# EAGLE design Router40 v1 (EAGLE 9.5.0)
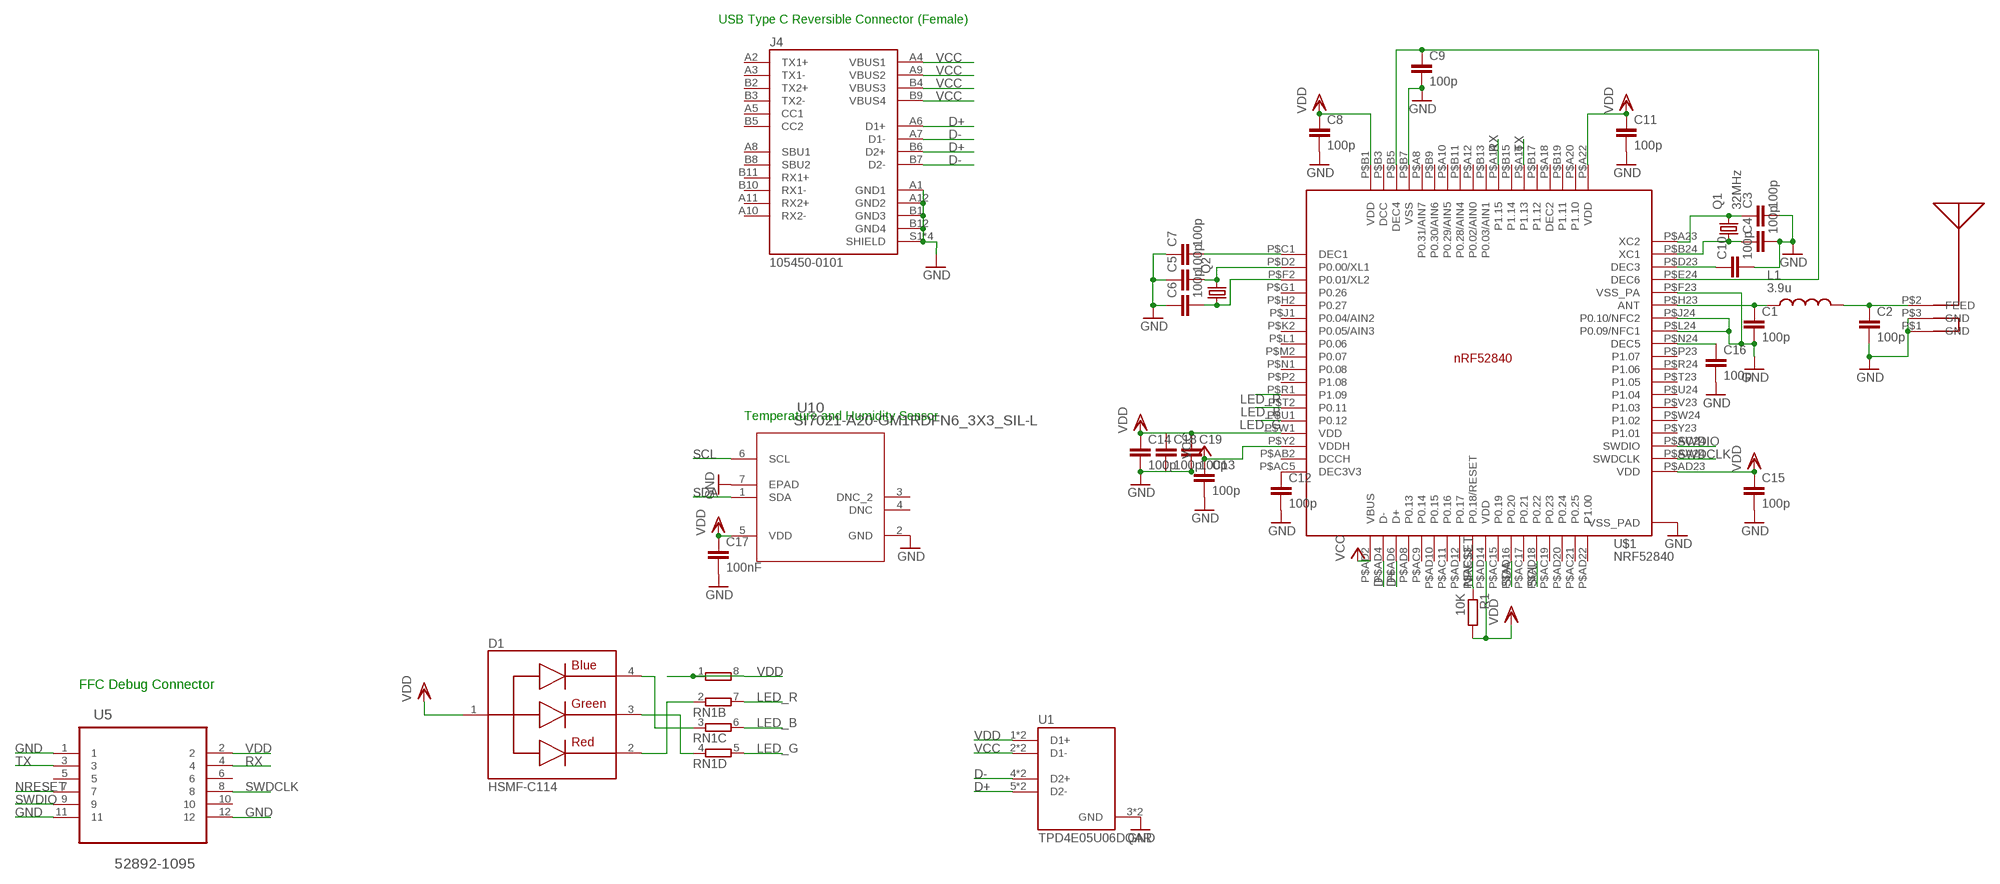
[diagram p0: schematic, sheet 1]

## Parts
C1  100p  CC0402  [C0402]
C2  100p  CC0402  [C0402]
C3  100p  CC0402  [C0402]
C4  100p  CC0402  [C0402]
C5  100p  CC0402  [C0402]
C6  100p  CC0402  [C0402]
C7  100p  CC0402  [C0402]
C8  100p  CC0402  [C0402]
C9  100p  CC0402  [C0402]
C10  100p  CC0402  [C0402]
C11  100p  CC0402  [C0402]
C12  100p  CC0402  [C0402]
C13  100p  CC0402  [C0402]
C14  100p  CC0402  [C0402]
C15  100p  CC0402  [C0402]
C16  100p  CC0402  [C0402]
C17  100nF  CC0402  [C0402]
C18  100p  CC0402  [C0402]
C19  100p  CC0402  [C0402]
D1  HSMF-C114  [DIOSC160X150X35-4N]
J4  105450-0101  [MOLEX_105450-0101]
L1  3.9u  MHQ0402P7N5JT000  [INDC0402X26N]
Q1  32MHz  KX-5  [2.0X1.6_KX-5]
Q2  KX-327-RT  [2.0X1.2]
R1  10K  RR0402  [R0402]
RN1  4R-N0402ARV341  [4X0402ARV341]
U1  TPD4E05U06DQAR  [TI_TPD4E05U06DQAR]
U5  52892-1095  [MOLEX_52892-1095]
U10  SI7021-A20-GM1RDFN6_3X3_SIL-L  [DFN6_3X3_SIL-L]
U$1  NRF52840  [AQFN50P700X700X85_HS-74N]
U$4  CHIPANTENNAL2  [CHIPANTENNAL2]

## Nets
D+: J4.A6(D1+) J4.B6(D2+) U1.5(D2-) U1.6(D2-) U$1.P$AD6(D+)
D-: J4.A7(D1-) J4.B7(D2-) U1.4(D2+) U1.7(D2+) U$1.P$AD4(D-)
GND: C1.2 C2.2 C3.2 C4.2 C5.1 C6.1 C7.1 C8.2 C9.2 C10.2 C11.2 C12.2 C13.2 C14.2 C15.2 C16.2 C17.2 C18.2 C19.2 J4.A1(GND1) J4.A12(GND2) J4.B1(GND3) J4.B12(GND4) J4.S1(SHIELD) J4.S2(SHIELD) J4.S3(SHIELD) J4.S4(SHIELD) U1.3(GND) U1.8(GND) U5.1 U5.11 U5.12 U10.2(GND) U10.7(EPAD) U$1.P$74(VSS_PAD) U$1.P$75(VSS_PAD) U$1.P$76(VSS_PAD) U$1.P$77(VSS_PAD) U$1.P$78(VSS_PAD) U$1.P$79(VSS_PAD) U$1.P$80(VSS_PAD) U$1.P$81(VSS_PAD) U$1.P$82(VSS_PAD) U$1.P$83(VSS_PAD) U$1.P$84(VSS_PAD) U$1.P$85(VSS_PAD) U$1.P$86(VSS_PAD) U$1.P$87(VSS_PAD) U$1.P$88(VSS_PAD) U$1.P$89(VSS_PAD) U$1.P$90(VSS_PAD) U$1.P$B7(VSS) U$1.P$F23(VSS_PA) U$1.P$J24(P0.10/NFC2) U$1.P$L24(P0.09/NFC1) U$4.P$1(GND) U$4.P$3(GND)
LED_B: RN1.6 U$1.P$T2(P0.11)
LED_G: RN1.5 U$1.P$U1(P0.12)
LED_R: RN1.7 U$1.P$R1(P1.09)
N$1: C1.1 L1.1 U$1.P$H23(ANT)
N$2: C2.1 L1.2 U$4.P$2(FEED)
N$3: C3.1 Q1.3 U$1.P$A23(XC2)
N$4: C4.1 Q1.1 U$1.P$B24(XC1)
N$5: C5.2 Q2.2 U$1.P$D2(P0.00/XL1)
N$6: C6.2 Q2.1 U$1.P$F2(P0.01/XL2)
N$7: C7.2 U$1.P$C1(DEC1)
N$8: C9.1 U$1.P$B5(DEC4) U$1.P$E24(DEC6)
N$9: C10.1 U$1.P$D23(DEC3)
N$10: C12.1 U$1.P$AC5(DEC3V3)
N$12: C16.1 U$1.P$N24(DEC5)
N$16: D1.2 RN1.2
N$17: D1.3 RN1.4
N$18: D1.4 RN1.3
NRESET: R1.1 U5.7 U$1.P$AC13(P0.18/RESET)
RX: U5.4 U$1.P$A14(P1.15)
SCL: U10.6(SCL) U$1.P$AD18(P0.22)
SDA: U10.1(SDA) U$1.P$AD16(P0.20)
SWDCLK: U5.8 U$1.P$AA24(SWDCLK)
SWDIO: U5.9 U$1.P$AC24(SWDIO)
TX: U5.3 U$1.P$A16(P1.13)
VCC: C13.1 J4.A4(VBUS1) J4.A9(VBUS2) J4.B4(VBUS3) J4.B9(VBUS4) U1.2(D1-) U1.9(D1-) U$1.P$AD2(VBUS) U$1.P$Y2(VDDH)
VDD: C8.1 C11.1 C14.1 C15.1 C17.1 C18.1 C19.1 D1.1 R1.2 RN1.1 RN1.8 U1.1(D1+) U1.10(D1+) U5.2 U10.5(VDD) U$1.P$A22(VDD) U$1.P$AD14(VDD) U$1.P$AD23(VDD) U$1.P$B1(VDD) U$1.P$W1(VDD)
Unconnected: J4.A2(TX1+) J4.A3(TX1-) J4.A5(CC1) J4.A8(SBU1) J4.A10(RX2-) J4.A11(RX2+) J4.B2(TX2+) J4.B3(TX2-) J4.B5(CC2) J4.B8(SBU2) J4.B10(RX1-) J4.B11(RX1+) U5.5 U5.6 U5.10 U10.3(DNC_2) U10.4(DNC) U$1.P$A8(P0.31/AIN7) U$1.P$A10(P0.29/AIN5) U$1.P$A12(P0.02/AIN0) U$1.P$A18(DEC2) U$1.P$A20(P1.10) U$1.P$AB2(DCCH) U$1.P$AC9(P0.14) U$1.P$AC11(P0.16) U$1.P$AC15(P0.19) U$1.P$AC17(P0.21) U$1.P$AC19(P0.23) U$1.P$AC21(P0.25) U$1.P$AD8(P0.13) U$1.P$AD10(P0.15) U$1.P$AD12(P0.17) U$1.P$AD20(P0.24) U$1.P$AD22(P1.00) U$1.P$B3(DCC) U$1.P$B9(P0.30/AIN6) U$1.P$B11(P0.28/AIN4) U$1.P$B13(P0.03/AIN1) U$1.P$B15(P1.14) U$1.P$B17(P1.12) U$1.P$B19(P1.11) U$1.P$G1(P0.26) U$1.P$H2(P0.27) U$1.P$J1(P0.04/AIN2) U$1.P$K2(P0.05/AIN3) U$1.P$L1(P0.06) U$1.P$M2(P0.07) U$1.P$N1(P0.08) U$1.P$P2(P1.08) U$1.P$P23(P1.07) U$1.P$R24(P1.06) U$1.P$T23(P1.05) U$1.P$U24(P1.04) U$1.P$V23(P1.03) U$1.P$W24(P1.02) U$1.P$Y23(P1.01)

## Notes on the sheet
- USB Type C Reversible Connector (Female)
- Temperature and Humidity Sensor
- FFC Debug Connector

## Library data of the parts
C1-C19 = eagle-ltspice:C: CAPACITOR, European symbol; SPICEMODEL: NONE; SPICEPREFIX: C
D1 = HSMF-C114:HSMF-C114: LED Tri-Color Blue/Green/Red 468nm/523nm/637nm 4-Pin Chip LED T/R; AVAILABILITY: Unavailable; DESCRIPTION: LED RGB DIFFUSED CHIP SMD; MF: Broadcom Limited; MP: HSMF-C114; PACKAGE: 0606 Broadcom; PRICE: None
J4 = 105450-0101:105450-0101: USB Shielded I/O Receptacle; Type C; Right Angle; Surface Mount; Gold over Nickel; AVAILABILITY: Unavailable; DESCRIPTION: USB-C (USB TYPE-C) USB 3.1 (USB 3.1 Gen 2, Superspeed+) Receptacle Connector 24 Position Surface Mount, Right Angle; Through Hole; MF: Molex; MP: 1054500101; PACKAGE: None; PRICE: None
L1 = MHQ0402P7N5JT000:MHQ0402P7N5JT000: 221 NH 5% GOLD TERMINAL; AVAILABILITY: Unavailable; DESCRIPTION: FIXED IND 7.5NH 200MA 1.2 OHM; MF: TDK; MP: MHQ0402P7N5JT000; PACKAGE: 0402 TDK; PRICE: None
Q1 = crystal-geyer_V1_0:KX: Quartz Crystals (MHz) SMD: KX - Serie Model Size l/w/h [mm] Frequency Range Frequency Stability Temp. Range [°C] Load Capacitance AECQ 200 availabel Datasheet KX-4 KX-5 KX-6 KX-7 KX-9A KX-9B KX-12A KX-12B KX-13 KX-20 KX-K KX-KS 1.6/1.2/0.3 2.0/1.6/0.45 2.5/2.0/0.55 3.2/2.5/0.8 5.0/3.2/1.0 5.0/3.2/1.1 6.0/3.5/1.1 6.0/3.5/1.0 7.0/5.0 /1.3 11.6/5.5/1.6 12.3/4.5/4.2 12.3/4.5/3.2 24.0 ~ 80.0 MHz 16.0 ~ 80.0 MHz 12.0 ~ 80.0 MHz 8.0 ~ 60.0 MHz 7,68 ~ 300,0 MHz 8,0 ~ 50,0 MHz 8,0 ~ 150,0 MHz 8,0 ~ 50,0 MHz 6,0 ~ 160,0 MHz 3,579 ~ 25,0 MHz 3,579 ~ 70,0 MHz 3,579 ~ 70,0 MHz ±10 … ±50ppm ±10 … ±50ppm ±10 … ±50ppm ±10 … ±50ppm ±10 … ±50ppm ±10 … ±50ppm ±10 … ±50ppm ±10 … ±50ppm ±10 … ±50ppm ±50ppm ±10 … ±50ppm ±10 … ±50ppm (*) -40°C …+85°C (*) -40°C …+125°C (*) -40°C …+125°C (*) -40°C …+125°C (*) -40°C …+105°C (*) -40°C …+105°C (*) -40°C …+125°C (*) -40°C …+105°C (*) -40°C …+105°C (*) -40°C …+105°C (*) -40°C …+85°C (*) -40°C …+85°C 8, 8…16 8, 8…16 10, 8…16 12, 7…20 16, 10…20 16, 10…20 16, 10…20 16, 12…20 16, 12…20 16, 12…20 16, 12…30 16, 12…30 - yes yes yes - - - - - - - - KX-4.pdf <http://www.geyer-electronic.de/uploads/tx_userartikelfrequenz/GEYER-KX-4.pdf> KX-5.pdf <http://www.geyer-electronic.de/uploads/tx_userartikelfrequenz/GEYER-KX-5.pdf> KX-6.pdf <http://www.geyer-electronic.de/uploads/tx_userartikelfrequenz/GEYER-KX-6.pdf> KX-7.pdf <http://www.geyer-electronic.de/uploads/tx_userartikelfrequenz/GEYER-KX-7.pdf> KX-9A.pdf <http://www.geyer-electronic.de/uploads/tx_userartikelfrequenz/GEYER-KX-9A.pdf> KX-9B.pdf <http://www.geyer-electronic.de/uploads/tx_userartikelfrequenz/GEYER-KX-9B.pdf> KX-12A.pdf <http://www.geyer-electronic.de/uploads/tx_userartikelfrequenz/GEYER-KX-12A.pdf> KX-12B.pdf <http://www.geyer-electronic.de/uploads/tx_userartikelfrequenz/GEYER-KX-12B.pdf> KX-13.pdf <http://www.geyer-electronic.de/uploads/tx_userartikelfrequenz/GEYER-KX-13.pdf> KX-20.pdf <http://www.geyer-electronic.de/uploads/tx_userartikelfrequenz/GEYER-KX-20.pdf> KX-K.pdf <http://www.geyer-electronic.de/uploads/tx_userartikelfrequenz/GEYER-KX-K.pdf> KX-KS.pdf <http://www.geyer-electronic.de/uploads/tx_userartikelfrequenz/GEYER-KX-KS.pdf> <http://www.geyer-electronic.de/fileadmin/template/img/logo-geyer-electronic.png> Details see: http://www.geyer-electronic.de/Frequenz-Produkte.9.0.html Created 2016-06-07, Hans Locher 2016 (C) Geyer Quartz Technology KX4,KX5,KX6,KX7,KX9A,KX9B,KX12A,KX12B,KX13,KX20,KXK,KXKS;1612;2016;2520;3225;5032;6035;7050;11655;12345;1,6x1,2;2,0x1,6;2,5x2,0;3,2x2,5;5,0x3,2;6,0x3,5;7,0x5,0;11,6x5,5;12,3x4,5;12,3x4,5;1.6x1.2;2.0x1.6;2.5x2.0;3.2x2.5;5.0x3.2;6.0x3.5;7.0x5.0;11.6x5.5;12.3x4.5;12.3x4.5;
Q2 = crystal-geyer_V1_0:KX-327: Tuning Fork Crystals (kHz) SMD: KX327 - Serie Model Size l/w/h [mm] Frequency Range Frequency Stability Temp. Range [°C] Load Capacitance AECQ 200 availabel Datasheet KX-327VT KX-327FT KX-327RT KX-327NHT KX-327NHF KX-327L KX-327S 1.25/1.05/0.5 1.6/1.0/0.5 2.0/1.2/0.6 3.2/1.5/0.8 3.2/1.5/0.8 7.0/1.5/1.4 8.2/3.8/2.5 32,768 kHz 32,768 kHz 32,768 kHz 32,768 kHz 32,768 kHz 32,768 kHz 32,768 kHz ±10 … ±20ppm ±10 … ±20ppm ±10 … ±20ppm ±10 … ±20ppm ±10 … ±20ppm ±10 … ±20ppm ±5 … ±20ppm (*) -40°C …+85°C (*) -40°C …+85°C (*) -40°C …+85°C (*) -40°C …+85°C (*) -40°C …+125°C (*) -40°C …+85°C (*) -40°C …+85°C 7/9/12,5 7/9/12,5 7/9/12,6 7/9/12,5 9/12,5 7/9/12,5 6/12,5 - - - - yes - - KX-327VT.pdf <http://www.geyer-electronic.de/uploads/tx_userartikelfrequenz/GEYER-KX-327VT.pdf> KX-327FT.pdf <http://www.geyer-electronic.de/uploads/tx_userartikelfrequenz/GEYER-KX-327FT.pdf> KX-327RT.pdf <http://www.geyer-electronic.de/uploads/tx_userartikelfrequenz/GEYER-KX-327RT.pdf> KX-327NHT.pdf <http://www.geyer-electronic.de/uploads/tx_userartikelfrequenz/GEYER-KX-327NHT.pdf> KX-327NHF.pdf <http://www.geyer-electronic.de/uploads/tx_userartikelfrequenz/GEYER-KX-327NHF.pdf> KX-327L.pdf <http://www.geyer-electronic.de/uploads/tx_userartikelfrequenz/GEYER-KX-327L.pdf> KX-327S.pdf <http://www.geyer-electronic.de/uploads/tx_userartikelfrequenz/GEYER-KX-327S.pdf> <http://www.geyer-electronic.de/fileadmin/template/img/logo-geyer-electronic.png> Details see: http://www.geyer-electronic.de/Frequenz-Produkte.9.0.html Created 2016-06-07, Hans Locher 2016 (C) Geyer Quartz Technology KX327VT,KX327FT,KX327RT,KX327NHT,KX327NHF,KX327S,KX327L;125105;1610;2012;3215;7015;8238;1,25x1,05,1.25x1.05;1,6x1,0,1.6x1.0;2,0x1,2,2.0x1.2;3,2x1,5,3.2x1.5;8,2x3,8,8.2x3.8,7.0x1.5,7,0x1,532.768kHz
R1 = eagle-ltspice:R: RESISTOR, European symbol; SPICEMODEL: NONE; SPICEPREFIX: R
RN1 = resistor-dil:4R-N: Array Chip Resistor Source: RS Component / Phycomp; OC_FARNELL: unknown; OC_NEWARK: unknown
U1 = TPD4E05U06DQAR:TPD4E05U06DQAR: 4 Channel Ultra Low Capacitance IEC ESD Protection Diodes 10-USON -40 to 125 Check prices <https://pricing.snapeda.com/search/part/TPD4E05U06DQAR/?ref=eda>; AVAILABILITY: Warning; DESCRIPTION: 4-channel ultra-low-capacitance IEC ESD protection diode 10-USON -40 to 125; MF: Texas Instruments; MP: TPD4E05U06DQAR; PACKAGE: USON-10 Texas Instruments; PRICE: None; PURCHASE-URL: https://pricing.snapeda.com/search/part/TPD4E05U06DQAR/?ref=eda
U5 = 52892-1095:52892-1095: CONNECTOR, FPC, ZIF, 0.50MM, 10 WAY; AVAILABILITY: Unavailable; DESCRIPTION: Socket, r/a, Fpc, Zif, Smt, 10way; MF: Molex; MP: 52892-1095; PACKAGE: None; PRICE: None
U10 = SI7021:SI7021-A20-GM1R; BUILT_BY: EMA_Jessica; COPYRIGHT: Copyright (C) 2018 Accelerated Designs. All rights reserved; MANUFACTURER_PART_NUMBER: SI7021-A20-GM1R; SOURCELIBRARY: Silicon_Labs_2020-01-01; VENDOR: Silicon Labs
U$1 = Nordic_nRF:NRF52840: nRF52840 Features Advanced Single chip 2.4 GHz multi-protocol SoC 32-bit ARM Cortex-M4F Processor 1.7v to 5.5v operation 1MB flash + 256kB RAM Bluetooth 5 support for long range and high throughput 802.15.4 radio support On-chip NFC PPI –Programmable Peripheral Interconnect Automated power management system with automatic power management of each peripheral Configurable I/O mapping for analog and digital I/O 48 x GPIO 1 x QSPI 4 x Master/Slave SPI 2 x Two-wire interface (I²C) I²S interface 2 x UART 4 x PWM USB 2.0 controller ARM TrustZone CryptoCell-310 Cryptographic and security module AES 128-bit ECB/CCM/AAR hardware accelerator Digital microphone interface (PDM) Quadrature decoder 12-bit ADC Low power comparator On-chip 50Ω balun On-air compatible with nRF52, nRF51 and nRF24 Series Applications Advanced high performance wearables Wearables for secure payments Virtual Reality/Augmented Reality systems Smart Home sensor networks Smart city sensor networks High performance HID controllers Internet of Things (IoT) sensor networks Smart door locks Smart lighting networks Connected white goods
U$4 = CHIPANTENNA:CHIPANTENNAL2

## Board
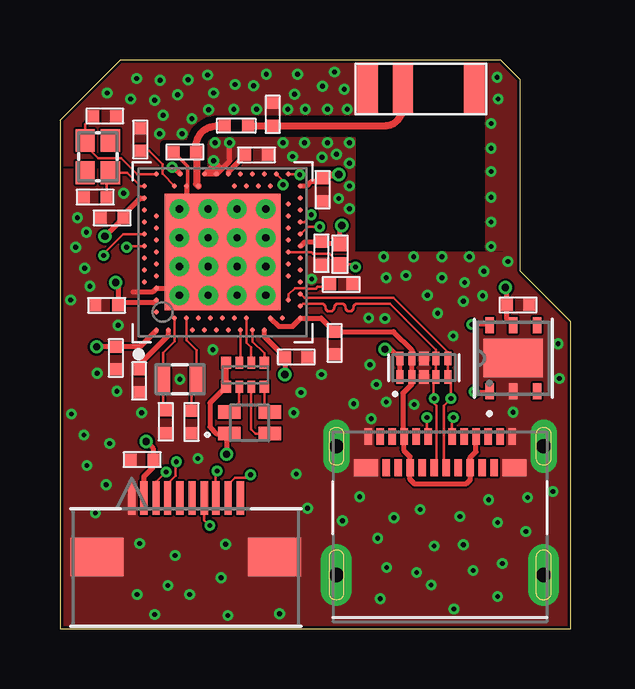
[diagram p1: board, top side]
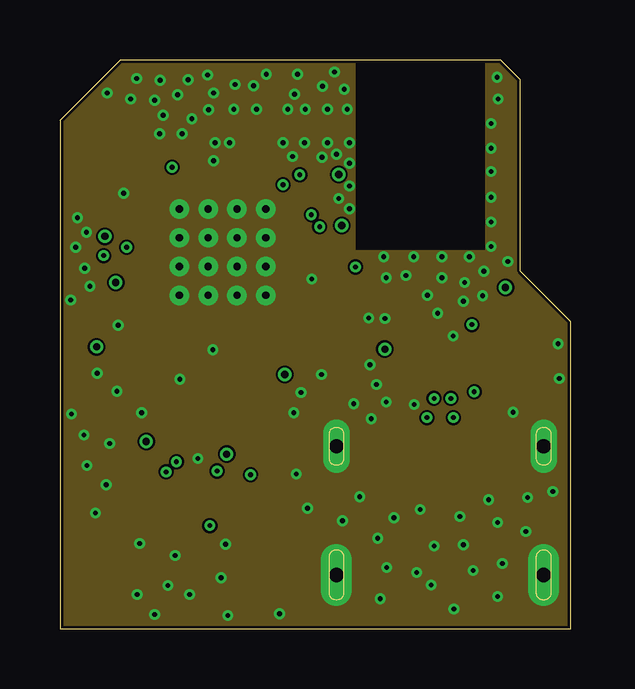
[diagram p2: board, inner layer Route2]
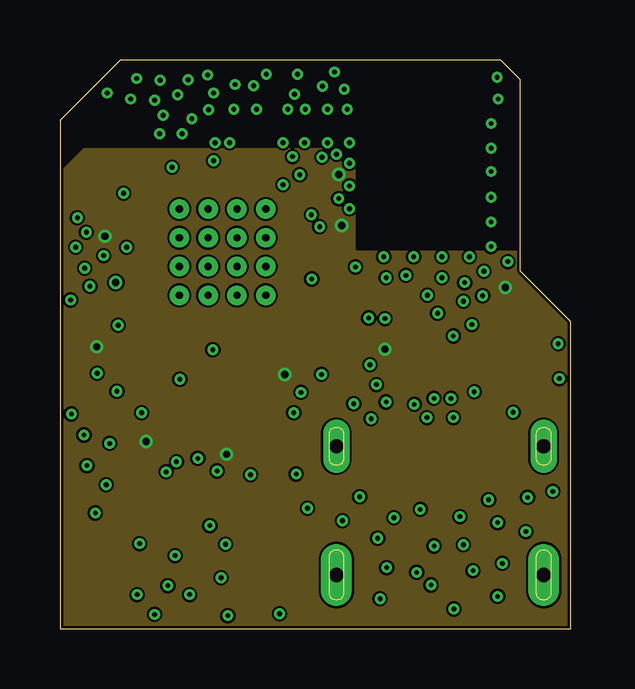
[diagram p3: board, inner layer Route15]
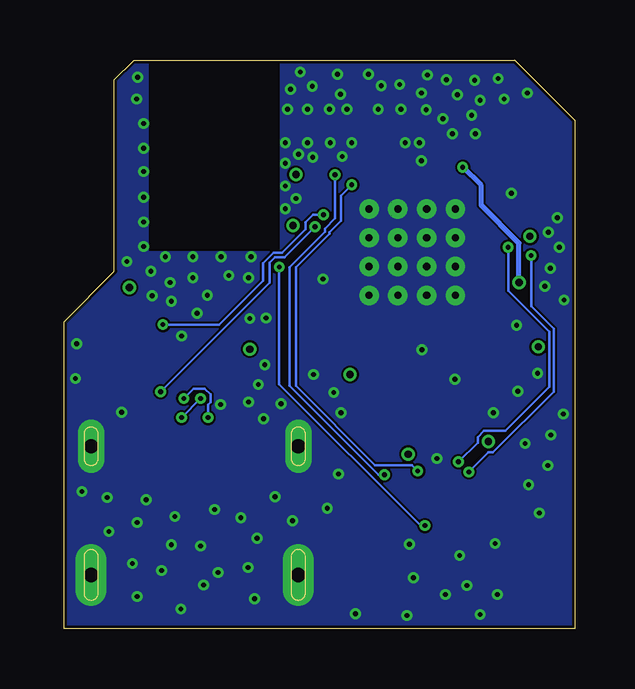
[diagram p4: board, bottom side, seen from below]

Size 21.3 x 23.7 mm. Coordinates in mm from the lower left corner, seen from the top.
Outline: 0,0 21.3,0 21.3,12.8 19.2,14.9 19.2,22.88 18.38,23.7 2.5,23.7 0,21.2 0,0
Copper layers (1+2*15+16): Top 0.035mm / dielectric 1.5mm / Route2 0.035mm / dielectric 0.15mm / Route15 0.035mm / dielectric 0.2mm / Bottom 0.035mm
Design rules "default *": minimum track width 3mil, minimum drill 0.2mm, track to track 3.5mil, track to pad 3.5mil, pad to pad 5mil, via to via 6mil, smd to smd 5mil, copper to edge 5mil, drill to drill 6mil, minimum pad ring 10mil, minimum via ring 0.125mm, stop-mask expansion 0mil, vias tented up to drill 40mil, thermal gap 0mil
tRestrict: area 4.3,19.4 to 5.2,20.2; 6 lines

### Footprints (pad centres in the part's own frame; a part is rotated, then mirrored left to right if it is on the bottom)
C0402 = smd 0.5 x 0.5: 1 -0.475,0; 2 0.475,0
DIOSC160X150X35-4N = smd 0.94 x 0.57: 1 -0.845,-0.45; 2 -0.845,0.45; 3 0.845,0.45; 4 0.845,-0.45
MOLEX_105450-0101 = smd 0.3 x 0.7: A1 -3,3.77; A2 -2.5,3.77; A3 -2,3.77; A4 -1.5,3.77; A5 -1,3.77; A6 -0.5,3.77; A7 0.5,3.77; A8 1,3.77; A9 1.5,3.77; A10 2,3.77; A11 2.5,3.77; A12 3,3.77; B2 2.25,2.47; B3 1.75,2.47; B4 1.25,2.47; B5 0.75,2.47; B6 0.25,2.47; B7 -0.25,2.47; B8 -0.75,2.47; B9 -1.25,2.47; B10 -1.75,2.47; B11 -2.25,2.47 | smd 1 x 0.7: B1 3.1,2.47; B12 -3.1,2.47 | drill 0.6 pad 1.1 long: S1 -4.32,3.36; S2 4.32,3.36 | drill 0.6 pad 1.3 long: S3 -4.32,-2; S4 4.32,-2
INDC0402X26N = smd 0.5 x 0.5: 1 -0.732,0; 2 0.232,0
2.0X1.6_KX-5 = smd 0.95 x 0.8: 1 -0.675,-0.525; 2 0.675,-0.525; 3 0.675,0.525; 4 -0.675,0.525
2.0X1.2 = smd 0.6 x 1.1: 1 -0.7,0; 2 0.7,0
R0402 = smd 0.6 x 0.55: 1 -0.425,0; 2 0.425,0
4X0402ARV341 = smd 0.4 x 0.5: 1 -0.8,-0.5; 4 0.8,-0.5; 5 0.8,0.5; 8 -0.8,0.5 | smd 0.3 x 0.5: 2 -0.25,-0.5; 3 0.25,-0.5; 6 0.25,0.5; 7 -0.25,0.5
TI_TPD4E05U06DQAR = smd 0.55 x 0.3: 1 -0.385,1; 2 -0.385,0.5; 4 -0.385,-0.5; 5 -0.385,-1; 6 0.385,-1; 7 0.385,-0.5; 9 0.385,0.5; 10 0.385,1 | smd 0.55 x 0.4: 3 -0.385,0; 8 0.385,0
MOLEX_52892-1095 = smd 0.305 x 1.397: 1 2.261,2.896; 2 1.753,2.896; 3 1.245,2.896; 4 0.762,2.896; 5 0.254,2.896; 6 -0.254,2.896; 7 -0.762,2.896; 8 -1.245,2.896; 9 -1.753,2.896; 10 -2.261,2.896 | smd 2.21 x 1.6: 11 -3.702,5.359; 12 3.702,5.359
DFN6_3X3_SIL-L = smd 0.66 x 0.356: 1 -1.372,0.991; 2 -1.372,0; 3 -1.372,-0.991; 4 1.372,-0.991; 5 1.372,0; 6 1.372,0.991 | smd 1.6 x 2.489: 7 0,0
AQFN50P700X700X85_HS-74N = smd 4.85 x 4.85: P$74 0,0 | drill 0.3 pad 0.6: P$75 -1.8,1.8; P$76 -0.6,1.8; P$77 0.6,1.8; P$78 1.8,1.8; P$79 -1.8,0.6; P$80 -0.6,0.6; P$81 0.6,0.6; P$82 1.8,0.6; P$83 -1.8,-0.6; P$84 -0.6,-0.6; P$85 0.6,-0.6; P$86 1.8,-0.6; P$87 -1.8,-1.8; P$88 -0.6,-1.8; P$89 0.6,-1.8; P$90 1.8,-1.8 | smd 0.2 x 0.2: P$A8 -1.25,3.25; P$A10 -0.75,3.25; P$A12 -0.25,3.25; P$A14 0.25,3.25; P$A16 0.75,3.25; P$A18 1.25,3.25; P$A20 1.75,3.25; P$A22 2.25,3.25; P$A23 2.75,3.25; P$AA24 3.25,-2.25; P$AB2 -2.75,-2.5; P$AC5 -2,-2.75; P$AC9 -1,-2.75; P$AC11 -0.5,-2.75; P$AC13 0,-2.75; P$AC15 0.5,-2.75; P$AC17 1,-2.75; P$AC19 1.5,-2.75; P$AC21 2,-2.75; P$AC24 3.25,-2.75; P$AD2 -2.75,-3.25; P$AD4 -2.25,-3.25; P$AD6 -1.75,-3.25; P$AD8 -1.25,-3.25; P$AD10 -0.75,-3.25; P$AD12 -0.25,-3.25; P$AD14 0.25,-3.25; P$AD16 0.75,-3.25; P$AD18 1.25,-3.25; P$AD20 1.75,-3.25; P$AD22 2.25,-3.25; P$AD23 2.75,-3.25; P$B1 -3.25,2.75; P$B3 -2.5,2.75; P$B5 -2,2.75; P$B7 -1.5,2.75; P$B9 -1,2.75; P$B11 -0.5,2.75; P$B13 0,2.75; P$B15 0.5,2.75; P$B17 1,2.75; P$B19 1.5,2.75; P$B24 3.25,2.75; P$C1 -3.25,2.25; P$D2 -2.75,2; P$D23 2.75,2; P$E24 3.25,1.75; P$F2 -2.75,1.5; P$F23 2.75,1.5; P$G1 -3.25,1.25; P$H2 -2.75,1; P$H23 2.75,1; P$J1 -3.25,0.75; P$J24 3.25,0.75; P$K2 -2.75,0.5; P$L1 -3.25,0.25; P$L24 3.25,0.25; P$M2 -2.75,0; P$N1 -3.25,-0.25; P$N24 3.25,-0.25; P$P2 -2.75,-0.5; P$P23 2.75,-0.5; P$R1 -3.25,-0.75; P$R24 3.25,-0.75; P$T2 -2.75,-1; P$T23 2.75,-1; P$U1 -3.25,-1.25; P$U24 3.25,-1.25; P$V23 2.75,-1.5; P$W1 -3.25,-1.75; P$W24 3.25,-1.75; P$Y2 -2.75,-2; P$Y23 2.75,-2
CHIPANTENNAL2 = smd 0.85 x 2: P$1 0.45,1; P$2 1.925,1; P$3 4.9,1

### Placement (x,y rotation side)
C1  5.21,19.86 180 top
C2  8.88,21.43 90 top
C3  1.47,17.98 180 top
C4  1.87,21.36 0 top
C5  4.41,8.63 90 top
C6  5.49,8.62 90 top
C7  3.3,10.33 90 top
C8  2.33,11.29 270 top
C9  1.95,13.47 180 top
C10  3.35,20.39 90 top
C11  3.43,7.05 180 top
C12  11.73,14.35 0 top
C13  11.45,11.91 270 top
C14  2.17,17.12 180 top
C15  10.95,18.3 270 top
C16  8.2,19.75 0 top
C17  19.1,13.5 0 top
C18  10.9,15.65 270 top
C19  9.85,11.32 0 top
D1  7.91,8.59 0 top
J4  15.85,4.25 0 top
L1  7.61,20.96 0 top
Q1  1.57,19.68 270 top
Q2  5,10.4 180 top
R1  11.68,15.61 90 top
RN1  7.72,10.59 0 top
U1  15.18,10.88 90 top
U5  5.25,8.36 180 top
U10  18.9,11.28 90 top
U$1  6.78,15.7 90 top
U$4  12.38,21.49 0 top

### Tracks (layer width: path | path; a pad name or v marks a point on that pad's centre or on a via)
D+  (via drill 0.2)
  Top 0.102: U$1.P$AD6 10.05,13.95 10.2,13.8 13.9,13.8 16.18,11.53 U1.6 U1.5 16.3,10.37 v16.3,9.6 16,9.3 16,6.82 J4.B6 | J4.A6 15.3,8.07 v15.3,8.8
  Bottom 0.102: v15.3,8.8 15.3,9.33 15.2,9.43 15.2,9.77 15.43,10 15.9,10 v16.3,9.6
D-  (via drill 0.2)
  Top 0.102: U$1.P$AD4 10.13,13.54 10.91,13.54 arc-90 11.07,13.38 arc90 11.24,13.22 11.28,13.22 arc90 11.44,13.38 arc-90 11.6,13.54 11.75,13.54 arc-90 11.91,13.38 arc90 12.07,13.22 12.08,13.22 arc90 12.24,13.38 arc-90 12.4,13.54 13.76,13.54 15.68,11.62 U1.7 U1.4 15.57,10.39 15.57,9.62 v15.6,9.6 15.6,9.4 15.7,9.3 15.7,6.82 J4.B7 | v16.4,8.8 16.35,8.75 J4.A7
  Bottom 0.102: v15.6,9.6 v16.4,8.8
GND  (via drill 0.2)
  Top 0.15: U$1.P$F23 5.33,18.49 5.33,19.27 C1.2
  Top 0.2: U$1.P$F23 5.28,17.8 U$1.P$78 | U$1.P$75 4.68,14.2 U$1.P$B7 3.86,14.03 3.05,14.03 | U$1.P$L24 6.25,18.95 | 6.25,18.95 U$1.P$J24 6.4,19.32 | U$1.P$L24 6.4,19.07 | 6.4,19.32 6.4,19.07 | 6.4,19.32 | 6.4,19.32 v6.4,19.5 6.74,19.16 | 6.25,18.95 6.38,19.07 6.4,19.07 | U$1.P$L24 6.66,19.07 | 6.66,19.07 6.74,19.16 | 6.74,19.16 7.08,19.49 v7.08,20.25 | 6.4,19.07 6.66,19.07 | 6.66,19.07 6.41,19.32 6.4,19.32 | U$1.P$74 U$1.P$84
  other vias: 12.88,12.95 18.23,22.98 18.27,22.07 17.98,19.05 17.98,20.02 17.98,21.05 17.98,17.98 12.07,18.45 14.75,15.5 16.88,14.43 17.07,15.5 17.98,16.95 10.2,20.25 11.15,20.25 10.22,21.65 17.98,15.93 13.5,15.5 10.05,9.85 9.7,19.68 12.93,11 14.78,9.35 5.35,22.88 6.47,20.25 13.55,12.93 18.68,15.3 12.07,20.25 18.25,1.35 14.43,14.72 10.93,19.65 8.07,22.62 11.15,21.65 9.5,21.65 2.42,12.65 1.93,6 18.45,2.73 15.93,15.5 12.07,19.4 8.2,21.65 15.32,13.9 12.07,17.5 11.97,21.65 9.3,20.25 1,8.07 7.25,21.65 1.02,15.03 13.2,10.18 13.6,9.45 6.2,21.62 3.2,22.93 10.32,5.03 4.15,20.62 1.25,14.28 6.38,11.62 16.82,13.65 0.72,17.12 10.9,10.6 5.1,20.62 6.9,3.52 16.43,0.82 3.33,3.55 15.47,1.82 5.5,21.25 15.93,14.62 17.68,14.9 11.53,19.77 0.45,13.7 16.4,12.2 19.5,5.47 8.6,23.1 17.23,2.42 3.95,0.6 1.12,6.8 20.77,11.88 12.5,5.5 20.82,10.43 12.25,9.38 2.95,22.07 4.5,1.8 13.35,1.25 9.85,6.45 20.55,5.72 19.43,4.05 4.9,22.25 5.4,1.43 18.9,9.03 6.72,2.12 7,0.55 9.15,0.62 7.3,22.68 4.8,3.05 0.47,8.95 2.38,9.9 13.25,3.77 3.23,1.43 16.82,3.5 14.88,2.35 2.65,18.15 9.9,23.1 6.15,23.07 3.4,9 10.95,22.6 13.93,4.62 11.45,23.2 15.6,3.45 9.78,22.27 11.85,22.48 5,10.4 16.68,4.67 17.88,5.38 13.62,2.55 6.4,22.32 3.95,22.02 17.62,13.88 15.75,13.15 4.3,21.4 11.78,4.5 0.65,15.9 9.75,9 18.25,4.42 15.03,4.97 1.98,22.32 4.17,22.85 5.75,7.1 1.48,4.83 2.08,7.72 1.55,10.65 13.6,14.62 10.5,14.57 11.62,17.93 1.1,16.52 12.97,8.75
  pour Top: 12.28,23.73 12.28,19.3 0,19.3 0,23.73
  pour Top: 0.03,19.15 3.17,19.15 3.17,16.15 3.17,-0.03 0,-0.03 0,19.15
  pour Top: 3.2,12.1 21.3,12.1 21.3,0 3.2,0
  pour Top: 10.35,19.27 10.35,12.05 12.28,12.05 12.28,19.27
  pour Top: 12.3,15.7 21.43,15.7 21.43,12.03 12.3,12.03
  pour Top: 10.4,11.97 10.4,14.07 10.38,14.1 14.9,14.1 16.48,12.53 16.48,11.97 16.27,11.78 10.6,11.78
  pour Bottom: -0.03,21.18 2.58,23.77 12.28,23.77 12.28,15.7 21.32,15.7 21.32,0 0,0 0,21.18
  pour Route2: -0.03,21.18 2.58,23.77 12.28,23.77 12.28,15.75 21.32,15.75 21.32,0 0,0 0,21.18
  pour Top: 17.77,15.78 17.77,23.73 18.4,23.68 19.2,22.88 19.2,15.72
  pour Route2: 17.77,15.72 17.77,23.68 18.4,23.68 18.8,23.27 19.2,22.88 19.2,15.72
  pour Bottom: 17.8,15.75 17.8,23.7 18.43,23.65 19.23,22.85 19.23,15.7
  pour Top: 12.22,23.45 12.5,23.45 12.57,23.38 12.57,21.57 12.5,21.5 12.22,21.5 12.2,21.52 12.15,21.57 12.15,23.4 12.2,23.45
  pour Top: 17.62,23.45 17.9,23.45 17.98,23.38 17.98,21.57 17.9,21.5 17.62,21.5 17.6,21.52 17.55,21.57 17.55,23.4 17.6,23.45
LED_B
  Top 0.102: RN1.6 7.97,11.72 7.78,11.92 U$1.P$T2
LED_G
  Top 0.102: RN1.5 8.53,11.47 8.03,11.97 U$1.P$U1
LED_R
  Top 0.102: U$1.P$R1 7.53,11.14 RN1.7
N$1
  Top 0.3: U$1.P$H23 5.69,18.53 C1.1 5.68,20.11 arc-74 6.25,20.9 arc-23 L1.1
N$2
  Top 0.3: L1.2 C2.1 13.54,20.96 arc90 14.3,21.73 U$4.P$2
N$3
  Top 0.102: U$1.P$A23 3.35,18.45 2.8,19 Q1.3 1.94,18.84 C3.1
N$4
  Top 0.102: U$1.P$B24 3.23,18.95 2.56,19.61 1.58,19.61 1.05,20.15 Q1.1 1.05,21.02 C4.1
N$5
  Top 0.102: U$1.P$D2 4.78,11.98 4.3,11.5 Q2.2 4.3,9.21 C5.2
N$6
  Top 0.102: U$1.P$F2 5.28,12.02 5.7,11.6 Q2.1 5.49,10.19 C6.2
N$7
  Top 0.2: C7.2 3.3,11 4.53,12.23 U$1.P$C1
N$8  (via drill 0.2, 0.3)
  Top 0.2: U$1.P$B5 3.93,13.6 2.42,13.6 C9.1 2.42,14.32 v2.33,14.43 | v4.67,19.23 4.74,19.23 U$1.P$E24
  Bottom 0.2: v2.33,14.43 2.33,16.07 3.9,17.65 3.9,18.48 4.66,19.23 v4.67,19.23
N$9
  Top 0.102: U$1.P$D23 4.27,18.95 4.27,19.35 3.71,19.91 C10.1
N$10
  Top 0.102: U$1.P$AC5 9.53,13.93 9.8,14.2 10.3,14.2 10.33,14.17 10.67,14.17 10.74,14.25 11.15,14.25 | 11.11,14.2 11.15,14.25 | 11.15,14.25 C12.1
N$12
  Top 0.2: U$1.P$N24 7.03,19.04 7.72,19.73 C16.1
N$16
  Top 0.102: RN1.2 7.47,9.45 D1.2
N$17
  Top 0.102: RN1.4 8.53,9.26 D1.3
N$18
  Top 0.102: RN1.3 7.97,8.32 8.16,8.13 D1.4
NRESET  (via drill 0.2)
  Top 0.102: R1.1 11.69,15.19 | 11.69,15.19 | R1.1 12.21,15.19 v12.32,15.07 | R1.1 11.68,15.2 11.24,15.63 10.54,15.63 10.48,15.7 U$1.P$AC13 | U5.7 6.02,4.53 v6.25,4.3
  Bottom 0.102: v6.25,4.3 6.42,4.3 12.32,10.2 v12.32,15.07
RX  (via drill 0.2)
  Top 0.102: U5.4 4.49,6.04 4.83,6.37 4.83,6.93 v4.86,6.96 | U$1.P$A14 2.83,15.95 v2.78,15.89
  Bottom 0.102: v4.86,6.96 4.05,7.76 4.05,7.99 3.79,8.25 2.9,8.25 1.07,10.08 1.07,12.37 2.78,14.08 v2.78,15.89
SCL  (via drill 0.2)
  Top 0.102: U$1.P$AD18 10.17,16.95 v10.48,17.26 | U10.6 17.2,12.65 v17.18,12.68
  Bottom 0.102: v10.48,17.26 10.92,17.26 11.23,16.94 11.23,16.65 12.22,15.67 12.57,15.67 13,15.24 13,14.5 14.82,12.68 v17.18,12.68
SDA  (via drill 0.2)
  Top 0.102: U$1.P$AD16 10.34,16.75 v10.83,16.75 | U10.1 17.3,9.9 v17.27,9.88
  Bottom 0.102: v17.27,9.88 12.73,14.42 12.73,15.24 12.49,15.48 12.1,15.48 v10.83,16.75
SWDCLK  (via drill 0.2)
  Top 0.102: U$1.P$AA24 9.3,18.68 v9.3,18.5 | v6.55,6.58 6.5,6.53 U5.8
  Bottom 0.102: v9.3,18.5 9.75,18.05 9.75,17 10.24,16.51 10.24,16.46 11.63,15.06 11.63,10.13 8.33,6.82 6.8,6.82 v6.55,6.58
SWDIO  (via drill 0.2)
  Top 0.102: U$1.P$AC24 9.98,18.95 v10,18.92 | v7.94,6.42 7.82,6.3 7.3,6.3 7.01,6 U5.9
  Bottom 0.102: v10,18.92 10,17.1 10.43,16.67 10.43,16.54 11.9,15.06 11.9,10.12 8.19,6.42 v7.94,6.42
TX  (via drill 0.2)
  Top 0.102: U5.3 4.01,6.12 v4.42,6.54 | U$1.P$A16 2.64,16.45 1.82,15.62 v1.82,15.55
  Bottom 0.102: v4.42,6.54 3.61,7.35 3.41,7.35 0.88,9.88 0.88,12.51 1.82,13.45 v1.82,15.55
VCC
  Top 0.2: U$1.P$Y2 9.12,12.6 9.7,12.6 10.03,12.93 U$1.P$AD2 10.89,12.95 C13.1 13.91,12.38 14.68,11.62 U1.9 U1.2 14.68,10.2 14.3,9.82 14.3,8.06 J4.A4 14.35,7.42 14.6,7.17 J4.B9 14.6,6.22 14.8,6.03 16.93,6.03 17.1,6.2 J4.B4 17.1,7.12 17.35,7.38 J4.A9
VDD  (via drill 0.3)
  Top 0.2: U$1.P$B1 3.35,11.76 C8.1 1.53,11.76 v1.52,11.75 | U$1.P$A22 3.35,17.95 2.65,17.25 C14.1 v1.88,16.35 | C15.1 10.79,18.62 10.46,18.62 10.28,18.45 U$1.P$AD23 | U5.2 3.5,6.35 3.9,6.75 C11.1 3.9,7.5 v3.6,7.8 | RN1.8 RN1.1 6.25,9.41 6.25,8.4 6.51,8.13 D1.1 6.95,8.03 v6.95,7.28 | U$1.P$AD14 10.21,16.12 C18.1 10.99,16.04 R1.2 11.68,16.73 v11.75,16.8 | U$1.P$W1 8.53,12.17 C19.1 v9.38,10.6 | U10.5 18.62,12.92 C17.1 18.62,14.18 v18.57,14.22 | U1.1 U1.10 13.79,11.65 v13.55,11.65
  Top 0.3: C15.1 11.1,18.93 v11.63,18.93
  pour Route15: 0,19 1,20 12.28,20 12.28,15.72 21.32,15.72 21.32,-0.03 0,-0.03